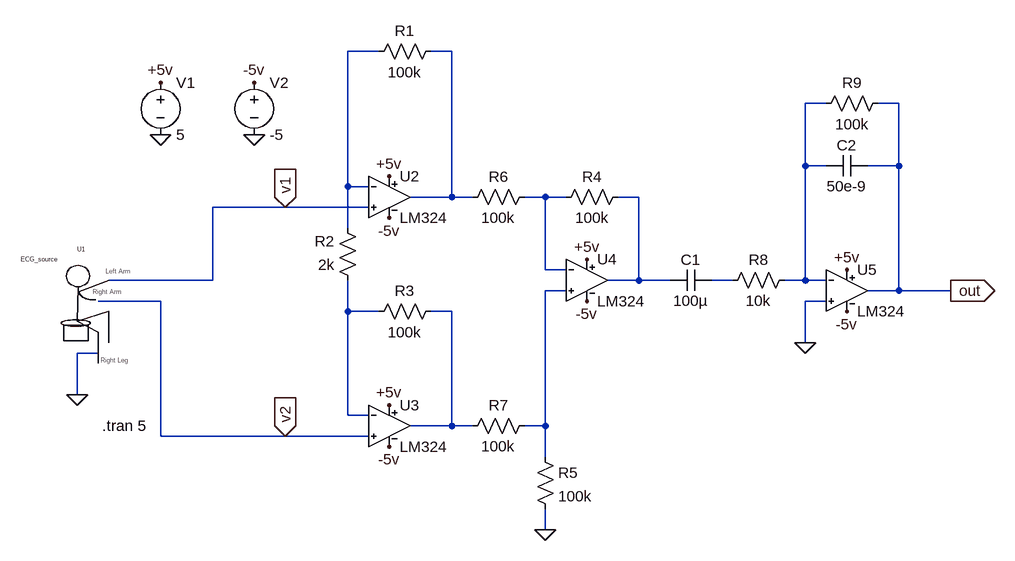
[diagram p0: schematic exp3.asc]
exp3.asc, the LTspice schematic file:
Version 4
SHEET 1 1520 680
WIRE 544 -336 496 -336
WIRE 656 -336 624 -336
WIRE 1232 -256 1200 -256
WIRE 1344 -256 1312 -256
WIRE 1200 -160 1200 -256
WIRE 1232 -160 1200 -160
WIRE 1344 -160 1344 -256
WIRE 1344 -160 1296 -160
WIRE 496 -128 496 -336
WIRE 528 -128 496 -128
WIRE 656 -112 656 -336
WIRE 656 -112 592 -112
WIRE 688 -112 656 -112
WIRE 800 -112 768 -112
WIRE 832 -112 800 -112
WIRE 944 -112 912 -112
WIRE 400 -96 288 -96
WIRE 528 -96 400 -96
WIRE 496 -64 496 -128
WIRE 800 0 800 -112
WIRE 832 0 800 0
WIRE 288 16 288 -96
WIRE 288 16 128 16
WIRE 944 16 944 -112
WIRE 944 16 896 16
WIRE 992 16 944 16
WIRE 1088 16 1056 16
WIRE 1200 16 1200 -160
WIRE 1200 16 1168 16
WIRE 1232 16 1200 16
WIRE 832 32 800 32
WIRE 1344 32 1344 -160
WIRE 1344 32 1296 32
WIRE 1424 32 1344 32
WIRE 208 48 112 48
WIRE 1232 48 1200 48
WIRE 496 64 496 16
WIRE 544 64 496 64
WIRE 656 64 624 64
WIRE 1200 112 1200 48
WIRE 112 128 80 128
WIRE 80 192 80 128
WIRE 496 224 496 64
WIRE 528 224 496 224
WIRE 656 240 656 64
WIRE 656 240 592 240
WIRE 688 240 656 240
WIRE 800 240 800 32
WIRE 800 240 768 240
WIRE 208 256 208 48
WIRE 400 256 208 256
WIRE 528 256 400 256
WIRE 800 288 800 240
WIRE 800 400 800 368
FLAG 80 192 0
FLAG 208 -208 0
FLAG 352 -208 0
FLAG 208 -288 +5v
FLAG 352 -288 -5v
FLAG 400 -96 v1
IOPIN 400 -96 In
FLAG 400 256 v2
IOPIN 400 256 In
FLAG 560 -144 +5v
FLAG 560 208 +5v
FLAG 560 -80 -5v
FLAG 560 272 -5v
FLAG 864 -16 +5v
FLAG 864 48 -5v
FLAG 1200 112 0
FLAG 800 400 0
FLAG 1264 0 +5v
FLAG 1264 64 -5v
FLAG 1424 32 out
IOPIN 1424 32 Out
SYMBOL human 80 64 R0
SYMATTR InstName U1
SYMBOL voltage 208 -304 R0
WINDOW 123 0 0 Left 0
WINDOW 39 0 0 Left 0
SYMATTR InstName V1
SYMATTR Value 5
SYMBOL voltage 352 -304 R0
WINDOW 123 0 0 Left 0
WINDOW 39 0 0 Left 0
SYMATTR InstName V2
SYMATTR Value -5
SYMBOL LM324 560 -176 R0
SYMATTR InstName U2
SYMBOL LM324 560 176 R0
SYMATTR InstName U3
SYMBOL LM324 864 -48 R0
SYMATTR InstName U4
SYMBOL LM324 1264 -32 R0
SYMATTR InstName U5
SYMBOL res 640 -352 R90
WINDOW 0 0 56 VBottom 2
WINDOW 3 32 56 VTop 2
SYMATTR InstName R1
SYMATTR Value 100k
SYMBOL res 512 32 R180
WINDOW 0 36 76 Left 2
WINDOW 3 36 40 Left 2
SYMATTR InstName R2
SYMATTR Value 2k
SYMBOL res 528 80 R270
WINDOW 0 32 56 VTop 2
WINDOW 3 0 56 VBottom 2
SYMATTR InstName R3
SYMATTR Value 100k
SYMBOL res 928 -128 R90
WINDOW 0 0 56 VBottom 2
WINDOW 3 32 56 VTop 2
SYMATTR InstName R4
SYMATTR Value 100k
SYMBOL res 784 272 R0
SYMATTR InstName R5
SYMATTR Value 100k
SYMBOL res 784 -128 R90
WINDOW 0 0 56 VBottom 2
WINDOW 3 32 56 VTop 2
SYMATTR InstName R6
SYMATTR Value 100k
SYMBOL res 784 224 R90
WINDOW 0 0 56 VBottom 2
WINDOW 3 32 56 VTop 2
SYMATTR InstName R7
SYMATTR Value 100k
SYMBOL cap 1056 0 R90
WINDOW 0 0 32 VBottom 2
WINDOW 3 32 32 VTop 2
SYMATTR InstName C1
SYMATTR Value 100µ
SYMBOL res 1184 0 R90
WINDOW 0 0 56 VBottom 2
WINDOW 3 32 56 VTop 2
SYMATTR InstName R8
SYMATTR Value 10k
SYMBOL res 1328 -272 R90
WINDOW 0 0 56 VBottom 2
WINDOW 3 32 56 VTop 2
SYMATTR InstName R9
SYMATTR Value 100k
SYMBOL cap 1296 -176 R90
WINDOW 0 0 32 VBottom 2
WINDOW 3 32 32 VTop 2
SYMATTR InstName C2
SYMATTR Value 50e-9
TEXT 118 240 Left 2 !.tran 5

The netlist it stands for:
* exp3.asc
XU1 v1 v2 0 ECG_source  ; pins LA RA RL
V1 +5v 0 5
V2 -5v 0 -5
XU2 v1 N001 +5v -5v N002 LM324  ; pins In+ In- V+ V- OUT
XU3 v2 N008 +5v -5v N009 LM324  ; pins In+ In- V+ V- OUT
XU4 N007 N004 +5v -5v N005 LM324  ; pins In+ In- V+ V- OUT
XU5 0 N003 +5v -5v out LM324  ; pins In+ In- V+ V- OUT
R1 N002 N001 100k
R2 N008 N001 2k
R3 N008 N009 100k
R4 N005 N004 100k
R5 N007 0 100k
R6 N004 N002 100k
R7 N007 N009 100k
C1 N006 N005 100µ
R8 N003 N006 10k
R9 out N003 100k
C2 out N003 50e-9
.tran 5
.lib human.sub
.lib LM324.lib
.backanno
.end